# EAGLE design untitled (EAGLE 9.6.2)
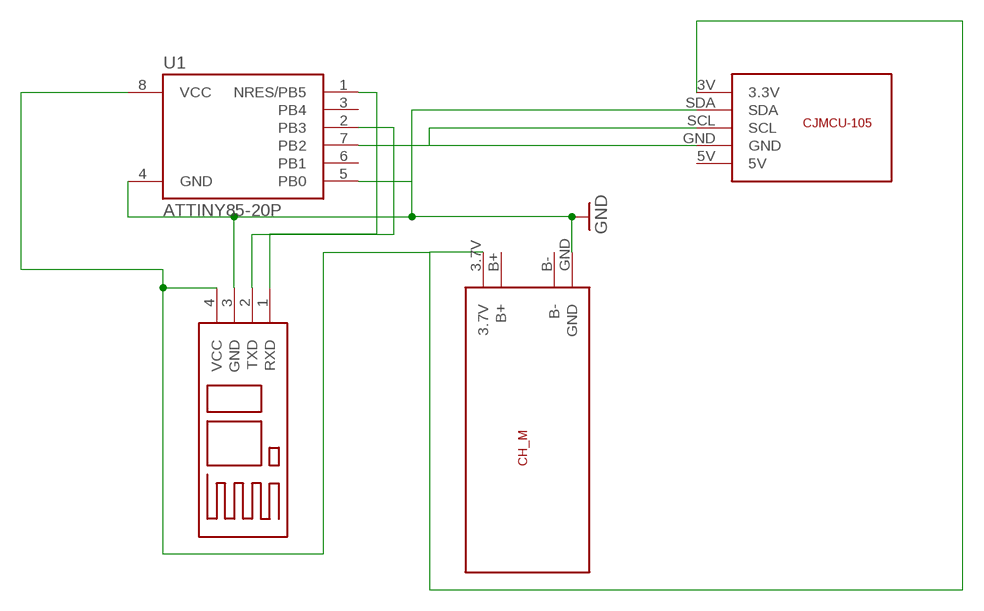
[diagram p0: schematic, sheet 1]

## Parts
B1  BLUETOOTH  [BLUETOOTH]
U1  ATTINY85-20P  [PDIP08_300MIL]
U$1  ADXLADXL  [CJMCU-105]
U$2  CH_MCH_M  [CHARGING_MODULE]

## Nets
GND: B1.3(GND) U1.4(GND) U$1.GND U$2.GND
N$2: B1.4(VCC) U1.8(VCC) U$1.3V(3.3V) U$2.3.7V
N$3: B1.1(RXD) U1.1(NRES/PB5)
N$4: B1.2(TXD) U1.2(PB3)
N$5: U1.5(PB0) U$1.SDA
N$6: U1.7(PB2) U$1.SCL
Unconnected: U1.3(PB4) U1.6(PB1) U$1.5V U$2.B+ U$2.B-

## Library data of the parts
B1 = Bluetooth:BLUETOOTH
U1 = _hhn_attiny25_45_85:ATTINY85*: ATMEL ATtiny 85 Packages: P = PDIP 08 30mil S = SOIC 08 EIAJ 208mil Technologies Note: for complete ordering code (temp. range, finish, tape&reel etc.) see www.atmel.com • Supply Voltage: V = (1.8…5.5)V | [blank] = (2.7…5.5)V • Speed: 10 = 10 MHz | 20 = 20 MHz Author: Dipl.-Ing. FH Rainer Bayer HHN Hochschule Heilbronn (Heilbronn University), rainer.bayer@hs-heilbronn.de Ingenieurbüro ing-rb, mail@ing-rb.de
U$1 = ADXL:ADXL
U$2 = ADXL:CH_M

## Board
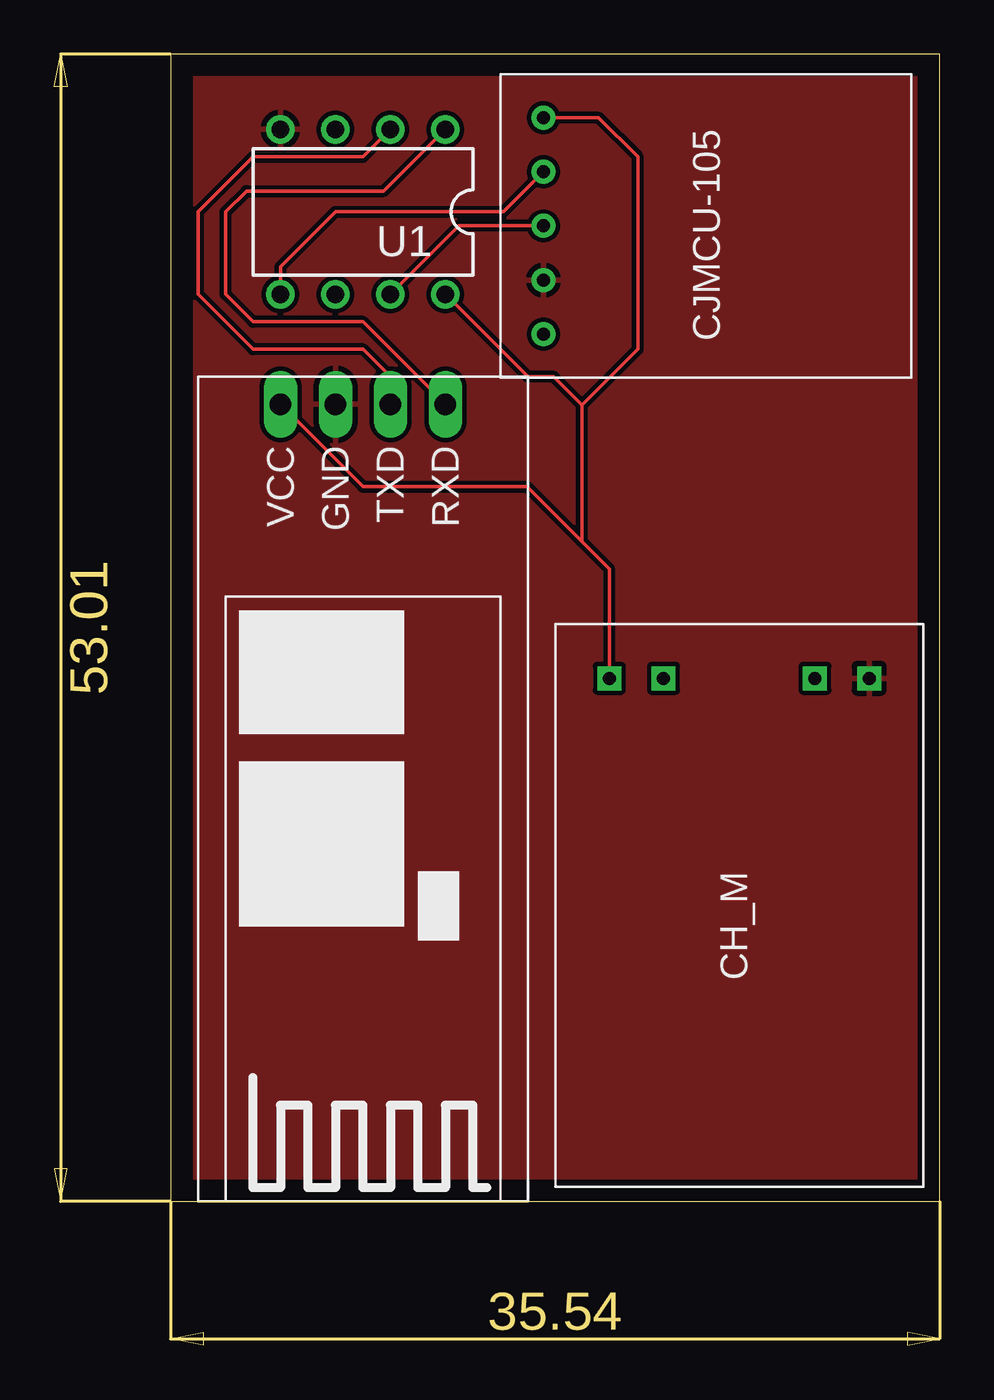
[diagram p1: board, top side]

Size 35.54 x 53.01 mm. Coordinates in mm from the lower left corner, seen from the top.
Outline: 0,0 35.54,0 35.54,53.01 0,53.01 0,0
Copper layers (1*16): Top 0.035mm / dielectric 1.5mm / Bottom 0.035mm
Design rules "default *": minimum track width 6mil, minimum drill 0.35mm, track to track 8mil, track to pad 6mil, pad to pad 6mil, via to via 6mil, smd to smd 6mil, copper to edge 40mil, drill to drill 6mil, minimum pad ring 10mil, minimum via ring 8mil, stop-mask expansion 4mil, vias tented up to drill 0mil, thermal gap 10mil

### Footprints (pad centres in the part's own frame; a part is rotated, then mirrored left to right if it is on the bottom)
BLUETOOTH = drill 1 pad 1.549 long: 1 -6.35,3.81; 2 -6.35,1.27; 3 -6.35,-1.27; 4 -6.35,-3.81
PDIP08_300MIL = drill 0.813: 1 -3.81,-3.81; 2 -1.27,-3.81; 3 1.27,-3.81; 4 3.81,-3.81; 5 3.81,3.81; 6 1.27,3.81; 7 -1.27,3.81; 8 -3.81,3.81
CJMCU-105 = drill 0.6: 3V 2,2; 5V 11.995,2; GND 9.495,2; SCL 6.995,2; SDA 4.495,2
CHARGING_MODULE = drill 0.6 square: 3.7V 2.5,2.5; B+ 2.5,5; B- 2.5,12; GND 2.5,14.5

### Placement (x,y rotation side)
B1  8.89,30.48 270 top
U1  8.89,45.72 180 top
U$1  15.24,52.07 270 top
U$2  17.78,26.67 270 top

### Tracks (layer width: path | path; a pad name or v marks a point on that pad's centre or on a via)
GND
  pour Top: 0,53.34 36.83,53.34 36.83,0 34.29,0 0,0
N$2
  Top 0.152: U$2.3.7V 20.28,29.21 19.01,30.48 | 19.01,30.48 19.01,36.79 | 19.01,36.79 21.59,39.37 21.59,48.26 19.78,50.07 U$1.3V | 19.01,36.79 17.7,38.1 16.51,38.1 U1.8 | B1.4 8.89,33.02 16.47,33.02 19.01,30.48
N$3
  Top 0.152: U1.1 9.86,46.69 3.5,46.69 2.54,45.72 2.54,41.91 3.81,40.64 8.89,40.64 B1.1
N$4
  Top 0.152: U1.2 8.89,48.26 3.81,48.26 1.27,45.72 1.27,41.91 3.81,39.37 8.89,39.37 10.16,38.1 B1.2
N$5
  Top 0.152: U$1.SDA 15.39,45.72 7.62,45.72 5.08,43.18 U1.5
N$6
  Top 0.152: U$1.SCL 13.32,45.08 U1.7